# EAGLE design hvsp (EAGLE 6.5.0)
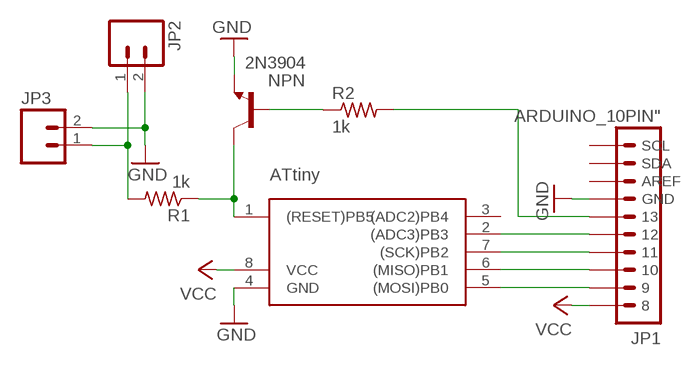
[diagram p0: schematic, sheet 1]

## Parts
JP1  ARDUINO_10PIN"  [ARDUINO_10PIN]
JP2  M025MM  [SCREWTERMINAL-5MM-2]
JP3  M021X02_NO_SILK  [1X02_NO_SILK]
NPN  2N3904  [TO92]
R1  1k  R-US_0204/7  [0204/7]
R2  1k  R-US_0204/7  [0204/7]
U$2  ATtiny  ATTINY858P3  [AVR-7_DIL08]

## Nets
GND: JP1.4(GND) JP2.2 JP3.2 NPN.3(E) U$2.4(GND)
N$1: NPN.2(B) R2.1
N$2: JP2.1 JP3.1 R1.2
N$3: JP1.6 U$2.2((ADC3)PB3)
N$4: JP1.7 U$2.7((SCK)PB2)
N$5: JP1.8 U$2.6((MISO)PB1)
N$6: JP1.9 U$2.5((MOSI)PB0)
N$7: JP1.5 R2.2
N$8: NPN.1(C) R1.1 U$2.1((RESET)PB5)
VCC: JP1.10 U$2.8(VCC)
Unconnected: JP1.1(SCL) JP1.2(SDA) JP1.3(AREF) U$2.3((ADC2)PB4)

## Library data of the parts
JP1 = hvsp:ARDUINO_10PIN: Header 10 Standard 10-pin 0.1" header. Use with straight break away headers (SKU : PRT-00116), right angle break away headers (PRT-00553), swiss pins (PRT-00743), machine pins (PRT-00117), and female headers (PRT-00115).
JP2 JP3 = SparkFun-Connectors:M02: Standard 2-pin 0.1" header. Use with - straight break away headers ( PRT-00116) - right angle break away headers (PRT-00553) - swiss pins (PRT-00743) - machine pins (PRT-00117) - female headers (PRT-00115) Molex polarized connector foot print use with: PRT-08233 with associated crimp pins and housings. 2.54_SCREWTERM for use with PRT-10571. 3.5mm Screw Terminal footprints for PRT-08084 5mm Screw Terminal footprints for use with PRT-08433
NPN = transistor:2N3904: NPN TRANSISTOR
R1 R2 = resistor:R-US_: RESISTOR, American symbol
U$2 = hvsp:ATTINY85

## Board
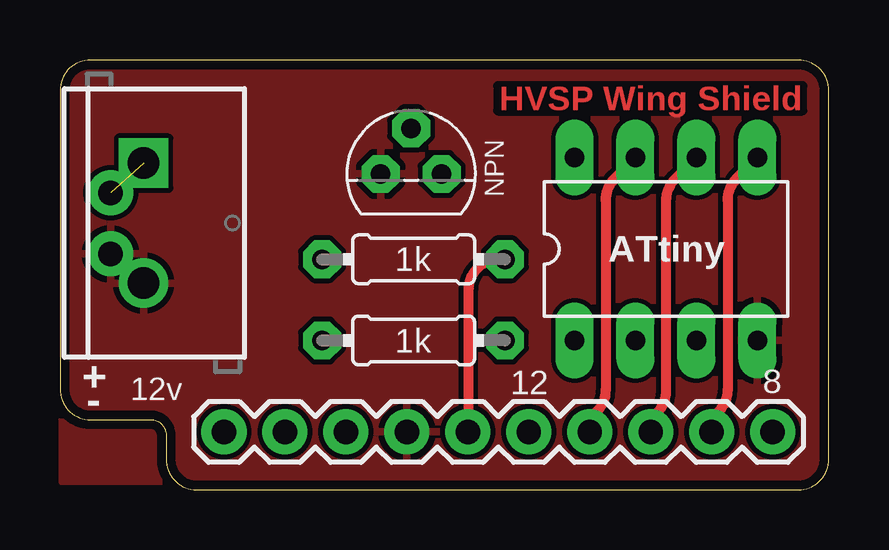
[diagram p1: board, top side]
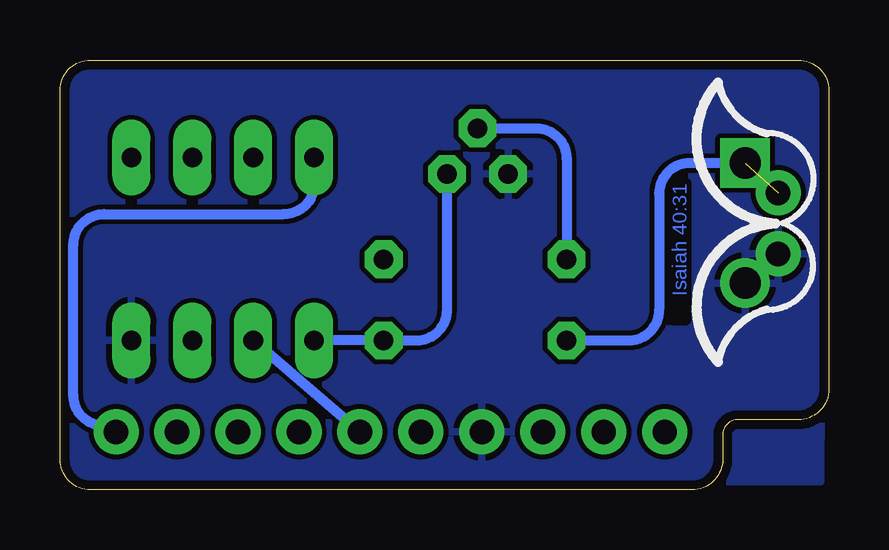
[diagram p2: board, bottom side, seen from below]

Size 32.03 x 17.91 mm. Coordinates in mm from the lower left corner, seen from the top.
Outline: 30.76,17.91 1.27,17.91 arc90 0,16.64 0,4.19 arc90 1.27,2.92 3.79,2.92 arc-90 4.42,2.29 4.42,1.27 arc90 5.69,0 30.76,0 arc90 32.03,1.27 32.03,16.64 arc90 30.76,17.91
Copper layers (1*16): Top 0.035mm / dielectric 1.5mm / Bottom 0.035mm
Design rules "default *": minimum track width 15mil, minimum drill 24mil, track to track 8mil, track to pad 8mil, pad to pad 8mil, via to via 8mil, smd to smd 8mil, copper to edge 15mil, drill to drill 8mil, minimum pad ring 15mil, minimum via ring 8mil, stop-mask expansion 4mil, vias tented up to drill 0mil, thermal gap 10mil

### Footprints (pad centres in the part's own frame; a part is rotated, then mirrored left to right if it is on the bottom)
ARDUINO_10PIN = drill 1.016 pad 1.88: 1 0,0; 2 2.54,0; 3 5.08,0; 4 7.62,0; 5 10.16,0; 6 12.7,0; 7 15.24,0; 8 17.78,0; 9 20.32,0; 10 22.86,0
SCREWTERMINAL-5MM-2 = drill 1.3 pad 2.032 square: 1 0,0 | drill 1.3 pad 2.032: 2 5,0
1X02_NO_SILK = drill 1.016 pad 1.88: 1 0,0; 2 2.54,0
TO92 = drill 0.813 octagon: 1 1.27,0; 2 0,1.905; 3 -1.27,0
0204/7 = drill 0.813 octagon: 1 -3.81,0; 2 3.81,0
AVR-7_DIL08 = drill 0.813 long: 1 -3.81,-3.81; 2 -1.27,-3.81; 3 1.27,-3.81; 4 3.81,-3.81; 5 3.81,3.81; 6 1.27,3.81; 7 -1.27,3.81; 8 -3.81,3.81

### Placement (x,y rotation side)
JP1  6.83,2.41 0 top
JP2  3.48,13.61 270 top
JP3  2.11,12.37 270 top
NPN  14.63,13.16 0 top
R1  14.73,6.22 180 top
R2  14.73,9.6 0 top
U$2  25.25,10.03 0 top

### Tracks (layer width: path | path; a pad name or v marks a point on that pad's centre or on a via)
GND
  pour Top: 31.98,0.41 0.1,0.33 0.15,17.81 32.03,17.88
  pour Bottom: 0.33,0.33 0.23,17.96 31.95,17.81 32.05,0.18
N$1
  Bottom 0.406: NPN.2 12.19,15.06 arc90 10.92,13.79 R2.1
N$2  (1 unrouted)
  Bottom 0.406: JP2.1 5.79,13.61 arc-90 7.06,12.34 7.06,7.49 arc90 8.33,6.22 R1.2
N$3
  Bottom 0.406: U$2.2 JP1.6
N$4
  Top 0.305: 22.36,3.26 22.07,2.97
  Top 0.406: U$2.7 23.11,12.97 arc45 22.73,12.07 22.73,4.16 arc-45 22.36,3.26 | 22.07,2.97 JP1.7
N$5
  Top 0.406: U$2.6 25.62,12.95 arc45 25.25,12.05 25.25,4.11 arc-45 24.88,3.21 24.61,2.95 JP1.8
N$6
  Top 0.406: U$2.5 28.18,12.97 arc45 27.81,12.07 27.81,4.16 arc-45 27.44,3.26 27.15,2.97 JP1.9
N$7
  Top 0.406: R2.2 18.29,9.6 arc90 17.02,8.33 17.02,3.56 16.99,2.9 JP1.5
N$8
  Bottom 0.406: U$2.1 R1.1 17.17,6.22 arc-90 15.9,7.49 NPN.1
VCC
  Bottom 0.305: 29.69,2.67 JP1.10
  Bottom 0.406: 29.69,2.67 30.2,2.67 arc90 31.47,3.94 31.47,10.21 arc90 30.2,11.48 22.71,11.48 arc-90 21.44,12.75 U$2.8

### Text on the board
Top: HVSP Wing Shield
Bottom: Isaiah 40:31
tNames: + | 12v | 12 | 8 | -
tStop: HVSP Wing Shield | HVSP Wing Shield | HVSP Wing Shield | HVSP Wing Shield | HVSP Wing Shield | http://bitkit.io